# Altium schematic sheet 原理图.SCHDOC
size A4
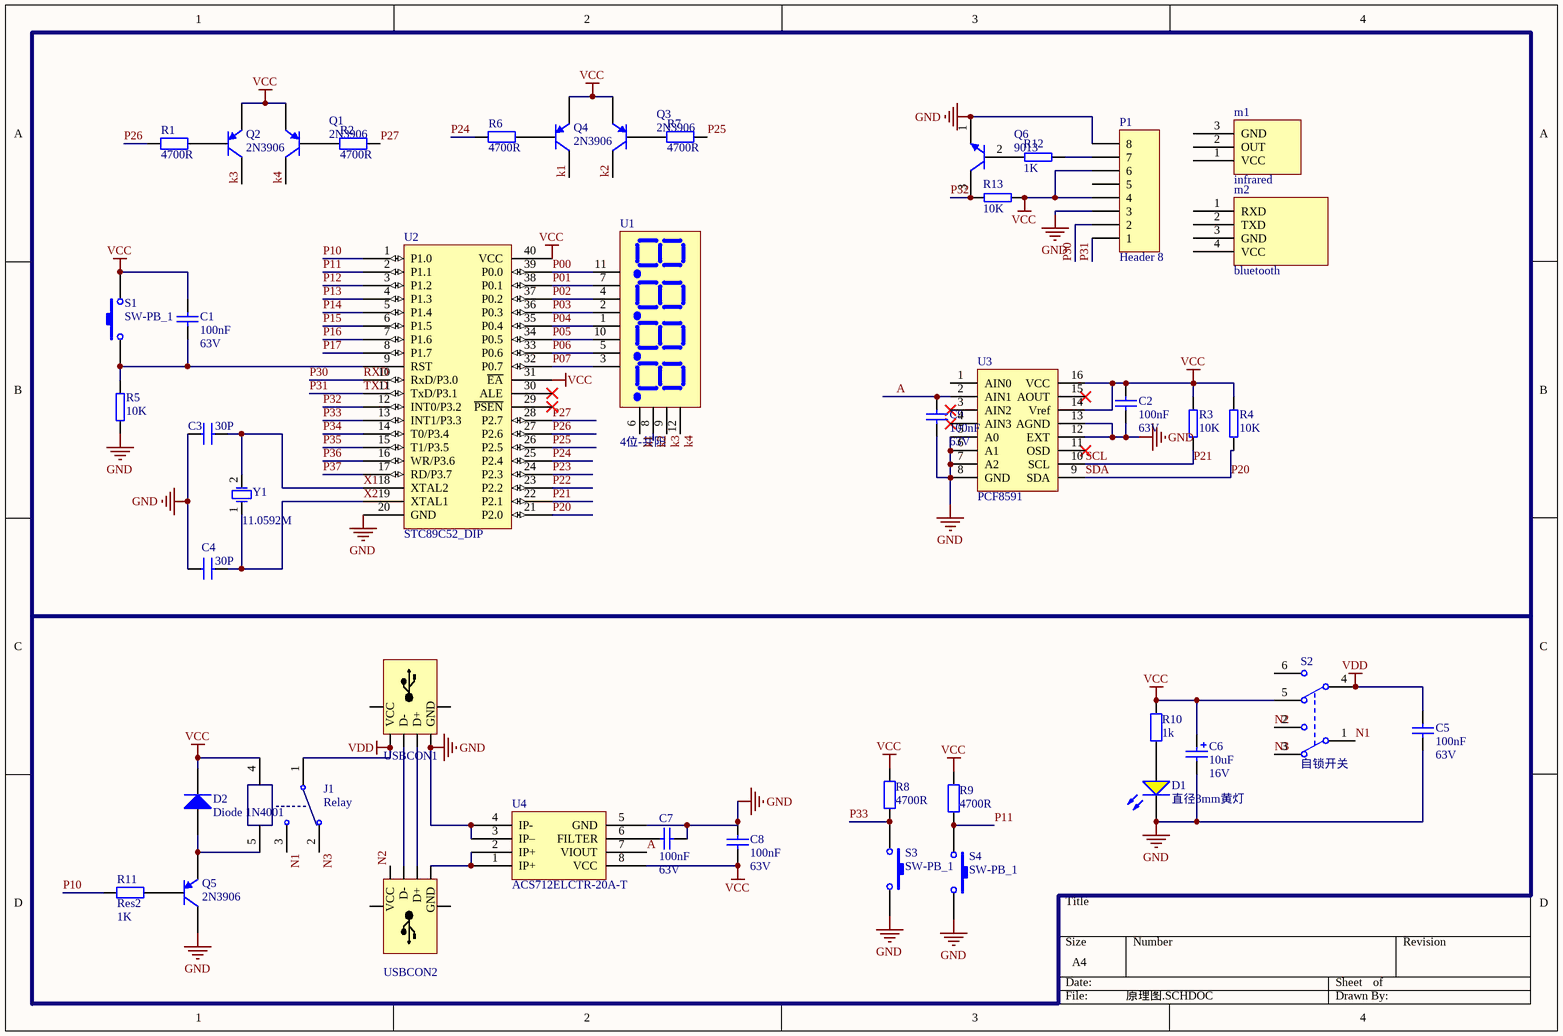
[diagram p0: 原理图.SCHDOC]

## Parts
C1  value 100nF  Voltage: 63V  [Capacitor-Disk-Middle]  (hidden comment: Cap Nicklon)
C2  value 100nF  Voltage: 63V  [Capacitor-Disk-Middle]  (hidden comment: Cap Nicklon)
C3  30P  [CAP-0.1]
C4  30P  [CAP-0.1]
C5  value 100nF  Voltage: 63V  [Capacitor-Disk-Middle]  (hidden comment: Cap Nicklon)
C6  value 10uF  Voltage: 16V  [CAPPR2-5X5]  (hidden comment: Cap Pol 2.5x6.3)
C7  value 100nF  Voltage: 63V  [Capacitor-Disk-Middle]  (hidden comment: Cap Nicklon)
C8  value 100nF  Voltage: 63V  [Capacitor-Disk-Middle]  (hidden comment: Cap Nicklon)
C9  value 100nF  Voltage: 63V  [Capacitor-Disk-Middle]  (hidden comment: Cap Nicklon)
D1  直径3mm黄灯  [LED_#3]
D2  Diode 1N4001  [DO-41]
J1  Relay  [RELAY-5]
m1  infrared  [infrared]
m2  bluetooth  [bluetooth]
P1  Header 8  [HDR1X8]
Q1  2N3906  [TO-92A]
Q2  2N3906  [TO-92A]
Q3  2N3906  [TO-92A]
Q4  2N3906  [TO-92A]
Q5  2N3906  [TO-92A]
Q6  9013  [TO-92-3L]
R1  4700R  [AXIAL-0.4]
R2  4700R  [AXIAL-0.4]
R3  10K  [AXIAL-0.4]
R4  10K  [AXIAL-0.4]
R5  10K  [AXIAL-0.4]
R6  4700R  [AXIAL-0.4]
R7  4700R  [AXIAL-0.4]
R8  4700R  [AXIAL-0.4]
R9  4700R  [AXIAL-0.4]
R10  1k  [AXIAL-0.4]
R11  Res2  value 1K  [AXIAL-0.4]
R12  1K  [AXIAL-0.4]
R13  10K  [AXIAL-0.4]
S1  SW-PB_1  [BUTTON_6*6]
S2  自锁开关  [sw_8.5mm]
S3  SW-PB_1  [BUTTON_6*6]
S4  SW-PB_1  [BUTTON_6*6]
U1  4位-共阳  [SEG4_3641]
U2  STC89C52_DIP  [DIP-40]
U3  PCF8591  [SOIC-16_300mil]
U4  ACS712ELCTR-20A-T  [SOIC-8_150mil]
USBCON1  USB-4P  [USB-A]  (value not drawn)
USBCON2  USB-4P  [USB-A]  (value not drawn)
Y1  11.0592M  [cry卧式]

## Nets
GND: C2.1 C3.1 C4.1 C5.2 C6.2 C7.2 C8.1 C9.1 D1.2 P1.3 P1.8 Q5.3(C) Q6.1(E) R5.1 S3.2 S4.2 U2.20(GND) U3.5(A0) U3.6(A1) U3.7(A2) U3.8(GND) U3.12(EXT) U3.13(AGND) U4.3(IP–) U4.4(IP-) U4.5(GND) USBCON1.4(GND)
VCC: C1.2 C2.2 C6.1 C8.2 D2.2(K) J1.4 P1.4 P1.6 Q1.1(E) Q2.1(E) Q3.1(E) Q4.1(E) R3.2 R4.2 R8.2 R9.2 R10.2 R13.2 S1.2 S2.5 U2.31(~{EA}) U2.40(VCC) U3.14(Vref) U3.16(VCC) U4.8(VCC)
VDD: C5.1 J1.1 S2.4 USBCON1.1(VCC)
A: C9.2 U3.2(AIN1) U4.7(VIOUT)
k1: Q4.3(C) U1.6(h1)
k2: Q3.3(C) U1.8(h2)
k3: Q2.3(C) U1.9(h3)
k4: Q1.3(C) U1.12(h4)
N1: J1.3 S2.1
N2: S2.2 USBCON2.1(VCC)
N3: J1.2 S2.3
P00: U1.11(a) U2.39(P0.0)
P01: U1.7(b) U2.38(P0.1)
P02: U1.4(c) U2.37(P0.2)
P03: U1.2(d) U2.36(P0.3)
P04: U1.1(e) U2.35(P0.4)
P05: U1.10(f) U2.34(P0.5)
P06: U1.5(g) U2.33(P0.6)
P07: U1.3(dp) U2.32(P0.7)
P10: R11.1 U2.1(P1.0)
P11: R9.1 S4.1 U2.2(P1.1)
P12: U2.3(P1.2)
P13: U2.4(P1.3)
P14: U2.5(P1.4)
P15: U2.6(P1.5)
P16: U2.7(P1.6)
P17: U2.8(P1.7)
P20: R4.1 U2.21(P2.0) U3.9(SDA)  [also labelled SDA]
P21: R3.1 U2.22(P2.1) U3.10(SCL)  [also labelled SCL]
P22: U2.23(P2.2)
P23: U2.24(P2.3)
P24: R6.2 U2.25(P2.4)
P25: R7.1 U2.26(P2.5)
P26: R1.2 U2.27(P2.6)
P27: R2.1 U2.28(P2.7)
P30: P1.2 U2.10(RxD/P3.0)  [also labelled RXD]
P31: P1.1 U2.11(TxD/P3.1)  [also labelled TXD]
P32: Q6.3(C) R13.1 U2.12(INT0/P3.2)
P33: R8.1 S3.1 U2.13(INT1/P3.3)
P34: U2.14(T0/P3.4)
P35: U2.15(T1/P3.5)
P36: U2.16(WR/P3.6)
P37: U2.17(RD/P3.7)
X1: C3.2 U2.18(XTAL2) Y1.2(OSC2)
X2: C4.2 U2.19(XTAL1) Y1.1(OSC1)
NetC1_1: C1.1 R5.2 S1.1 U2.9(RST)
NetC7_1: C7.1 U4.6(FILTER)
NetD1_1: D1.1 R10.1
NetD2_1: D2.1(A) J1.5 Q5.1(E)
NetP1_7: P1.7 R12.2
NetQ1_2: Q1.2(B) R2.2
NetQ2_2: Q2.2(B) R1.1
NetQ3_2: Q3.2(B) R7.2
NetQ4_2: Q4.2(B) R6.1
NetQ5_2: Q5.2(B) R11.2
NetQ6_2: Q6.2(B) R12.1
NetU4_1: U4.1(IP+) U4.2(IP+) USBCON2.4(GND)
NetUSBCON1_2: USBCON1.2(D-) USBCON2.2(D-)
NetUSBCON1_3: USBCON1.3(D+) USBCON2.3(D+)

Not connected (* = marked no-connect by the designer): m1 1(VCC) 2(OUT) 3(GND); m2 1(RXD) 2(TXD) 3(GND) 4(VCC); P1 5; S2 6; U2 29(~{PSEN})* 30(ALE)*; U3 1(AIN0) 3(AIN2)* 4(AIN3)* 11(OSD)* 15(AOUT)*; USBCON1 5(GND) 6(GND); USBCON2 5(GND) 6(GND)

## Library data of the parts
C1 C2 C9 = Cap Nicklon: Capacitor; Published: 8-Jun-2000; Revision: July-2002: Re-released for DXP Platform.; Publisher: Altium Limited
C3 C4 = CAP: 无极性电容
C5 C7 C8 = Cap Nicklon: CBB聚乙烯薄膜电容; Published: 8-Jun-2000; Revision: July-2002: Re-released for DXP Platform.; Publisher: Altium Limited; 实物样品照片: https://item.taobao.com/item.htm?spm=a230r.1.14.32.21fd24b7VWml4d&id=37914290992&ns=1&abbucket=13#detail
C6 = Cap Pol 2.5x6.3: Polarized Capacitor (Radial); Published: 8-Jun-2000; Revision: July-2002: Re-released for DXP Platform.; Publisher: Altium Limited
D1 = LED_3#黄灯: 直径3mm的发光二极管
D2 = Diode 1N4001: 1 Amp General Purpose Rectifier; Published: 8-Jun-2000; LatestRevisionDate: 17-Jul-2002; LatestRevisionNote: Re-released for DXP Platform.; DatasheetVersion: 1998; PackageVersion: Aug-1999; PackageReference: DO-41; Publisher: Altium Limited; PackageDescription: Diode, Axial; Body 5.2 x 2.7 mm (LxDia. max), Lead Dia. 0.86 mm (max); Code_JEDEC: DO-204-AL; ComponentLink1Description: Manufacturer Link; ComponentLink1URL: http://www.fairchildsemi.com/; ComponentLink2Description: Datasheet; ComponentLink2URL: http://www.fairchildsemi.com/ds/1N%2F1N4001.pdf
J1 = Relay: 继电器-单刀双置
P1 = Header 8: Header, 8-Pin; LatestRevisionDate: 17-Jul-2002; LatestRevisionNote: Re-released for DXP Platform.; Publisher: Altium Limited
Q1-Q5 = 2N3906: PNP General Purpose Amplifier; Published: 8-Jun-2000; LatestRevisionDate: 15-Jan-2003; LatestRevisionNote: PCB Footprint 'BCY-W3/D4.7' replaced; DatasheetVersion: 1997; PackageVersion: Sep-1998; PackageReference: TO-92A; Publisher: Altium Limited; PackageDescription: TO, Flat Index; 3 In-Line, Axial Leads; Body Dia. 4.5mm; Leads 0.51 x 0.48 mm (max); ComponentLink1Description: Manufacturer Link; ComponentLink1URL: http://www.fairchildsemi.com/; ComponentLink2Description: Datasheet; ComponentLink2URL: http://www.fairchildsemi.com/ds/2N%2F2N3906.pdf
Q6 = 9013_TO-92: NPN型小功率三极管; 管脚判断: s9014,s9013，s9015，s9012，s9018系列的晶体小功率三极管，把显示文字平面朝自己，从左向右依次为e发射极 b基极 c集电极; HelpURL: https://baike.baidu.com/item/9013%E4%B8%89%E6%9E%81%E7%AE%A1/10925006?fr=aladdin
R1 R2 R6-R10 = Res2_2W: Resistor 直插电阻 2W; Published: 8-Jun-2000; LatestRevisionDate: 17-Jul-2002; LatestRevisionNote: Re-released for DXP Platform.; PackageReference: AXIAL-0.4; Publisher: Altium Limited
  R1 R2 R6-R9: Value: 4700R
  R10: Value: 1k
R3-R5 R12 R13 = RES: 电阻
R11 = Res2: Resistor; Published: 8-Jun-2000; LatestRevisionDate: 17-Jul-2002; LatestRevisionNote: Re-released for DXP Platform.; PackageReference: AXIAL-0.4; Publisher: Altium Limited; PackageDescription: Axial Device, Thru-Hole; 2 Leads; 0.4 in Pin Spacing
S1 S3 S4 = SW-PB_1: Switch; Published: 24-Mar-1999; LatestRevisionDate: 17-Jul-2002; LatestRevisionNote: Re-released for DXP Platform.; PackageReference: SPST-2; Publisher: Altium Limited
S2 = SW DPDT
U1 = 4位-共阳: 4位一体共阳数码管 0.36英寸30mm*14mm*7.2mm; HelpURL: https://detail.tmall.com/item.htm?id=13286121313&ali_refid=a3_430583_1006:1104520036:N:4%E4%BD%8D%E6%97%B6%E9%92%9F%E6%95%B0%E7%A0%81%E7%AE%A1:3646a0f2da44255190f9d12f1f7a258e&ali_trackid=1_3646a0f2da44255190f9d12f1f7a258e&spm=a230r.1.14.1.71e01f57Ca6Hpo
U3 = PCF8591: PCF8591 AD采集芯片
U4 = ACS712ELCTR-20A-T: 传感器; ComponentLink1Description: 供应商链接; ComponentLink1URL: http://www.szlcsc.com/product/details_11225.html; Package: SOIC-8_150mil; Supplier: LC; SuppliersPartNumber: C10681
USBCON1 USBCON2 = USB-4P: USB CONNECTOR
Y1 = XTAL DIP: 晶振